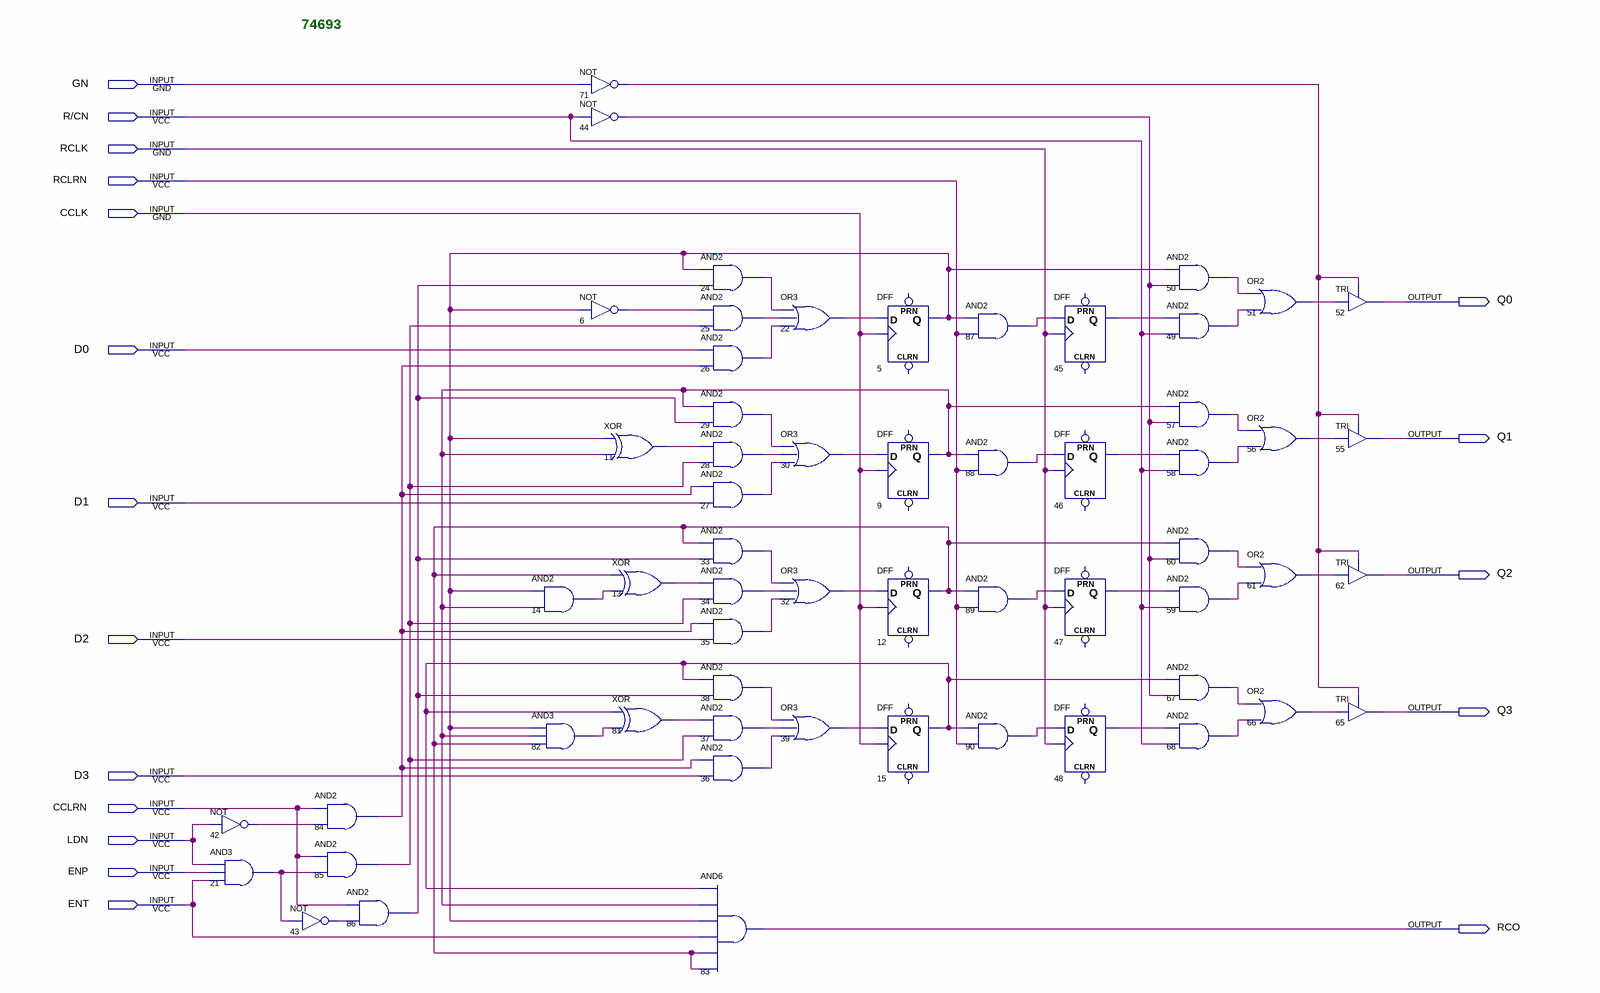
[diagram p0: schematic sheet]
// Quartus schematic 74693.bdf as structural Verilog: 59 symbols, 18 pins
module \74693  (
  input  GN,
  input  \R/CN ,
  input  RCLK,
  input  RCLRN,
  input  CCLK,
  input  D0,
  input  D1,
  input  D2,
  input  D3,
  input  CCLRN,
  input  LDN,
  input  ENP,
  input  ENT,
  output Q0,
  output Q1,
  output Q2,
  output Q3,
  output RCO
);

  wire n5_q, n6_out, n9_q, n11_out, n12_q, n13_out, n14_out, n15_q, n21_out, n22_out, n24_out, n25_out,
       n26_out, n27_out, n28_out, n29_out, n30_out, n32_out, n33_out, n34_out, n35_out, n36_out, n37_out,
       n38_out, n39_out, n42_out, n43_out, n44_out, n45_q, n46_q, n47_q, n48_q, n49_out, n50_out, n51_out,
       n56_out, n57_out, n58_out, n59_out, n60_out, n61_out, n66_out, n67_out, n68_out, n71_out, n81_out,
       n82_out, n84_out, n85_out, n86_out, n87_out, n88_out, n89_out, n90_out;

  not u_42 (n42_out, LDN);
  and u_21 (n21_out, LDN, ENP, ENT);
  and u_84 (n84_out, CCLRN, n42_out);
  and u_85 (n85_out, CCLRN, n21_out);
  not u_43 (n43_out, n21_out);
  and u_86 (n86_out, CCLRN, n43_out);
  not u_71 (n71_out, GN);
  not u_44 (n44_out, \R/CN );
  not u_6 (n6_out, n5_q);
  and u_14 (n14_out, n5_q, n9_q);
  and u_82 (n82_out, n5_q, n9_q, n12_q);
  xor u_11 (n11_out, n5_q, n9_q);
  xor u_13 (n13_out, n12_q, n14_out);
  xor u_81 (n81_out, n15_q, n82_out);
  and u_24 (n24_out, n5_q, n86_out);
  and u_25 (n25_out, n6_out, n85_out);
  and u_26 (n26_out, D0, n84_out);
  and u_29 (n29_out, n9_q, n86_out);
  and u_28 (n28_out, n11_out, n85_out);
  and u_27 (n27_out, n84_out, D1);
  and u_33 (n33_out, n12_q, n86_out);
  and u_34 (n34_out, n13_out, n85_out);
  and u_35 (n35_out, n84_out, D2);
  and u_38 (n38_out, n15_q, n86_out);
  and u_37 (n37_out, n81_out, n85_out);
  and u_36 (n36_out, n84_out, D3);
  and u_83 (RCO, n15_q, n9_q, n5_q, ENT, n12_q, n12_q);
  or u_22 (n22_out, n24_out, n25_out, n26_out);
  or u_30 (n30_out, n29_out, n28_out, n27_out);
  or u_32 (n32_out, n33_out, n34_out, n35_out);
  or u_39 (n39_out, n38_out, n37_out, n36_out);
  DFF u_5 (.CLK(CCLK), .D(n22_out), .Q(n5_q));  // open: CLRN, PRN
  DFF u_9 (.CLK(CCLK), .D(n30_out), .Q(n9_q));  // open: CLRN, PRN
  DFF u_12 (.CLK(CCLK), .D(n32_out), .Q(n12_q));  // open: CLRN, PRN
  DFF u_15 (.CLK(CCLK), .D(n39_out), .Q(n15_q));  // open: CLRN, PRN
  and u_87 (n87_out, n5_q, RCLRN);
  and u_88 (n88_out, n9_q, RCLRN);
  and u_89 (n89_out, n12_q, RCLRN);
  and u_90 (n90_out, n15_q, RCLRN);
  DFF u_45 (.CLK(RCLK), .D(n87_out), .Q(n45_q));  // open: CLRN, PRN
  DFF u_46 (.CLK(RCLK), .D(n88_out), .Q(n46_q));  // open: CLRN, PRN
  DFF u_47 (.CLK(RCLK), .D(n89_out), .Q(n47_q));  // open: CLRN, PRN
  DFF u_48 (.CLK(RCLK), .D(n90_out), .Q(n48_q));  // open: CLRN, PRN
  and u_50 (n50_out, n5_q, n44_out);
  and u_49 (n49_out, n45_q, \R/CN );
  and u_57 (n57_out, n9_q, n44_out);
  and u_58 (n58_out, n46_q, \R/CN );
  and u_60 (n60_out, n12_q, n44_out);
  and u_59 (n59_out, n47_q, \R/CN );
  and u_67 (n67_out, n15_q, n44_out);
  and u_68 (n68_out, n48_q, \R/CN );
  or u_51 (n51_out, n50_out, n49_out);
  or u_56 (n56_out, n57_out, n58_out);
  or u_61 (n61_out, n60_out, n59_out);
  or u_66 (n66_out, n67_out, n68_out);
  TRI u_52 (.IN(n51_out), .OE(n71_out), .OUT(Q0));
  TRI u_55 (.IN(n56_out), .OE(n71_out), .OUT(Q1));
  TRI u_62 (.IN(n61_out), .OE(n71_out), .OUT(Q2));
  TRI u_65 (.IN(n66_out), .OE(n71_out), .OUT(Q3));

  // Notes on the sheet:
  //   74693
endmodule
